# EasyEDA schematic schematic.json
TITLE: Sheet_1; REV: 1.0; Date: 2024-06-18; Sheet: 1/1; Drawn By: natanon; Company: Your Company
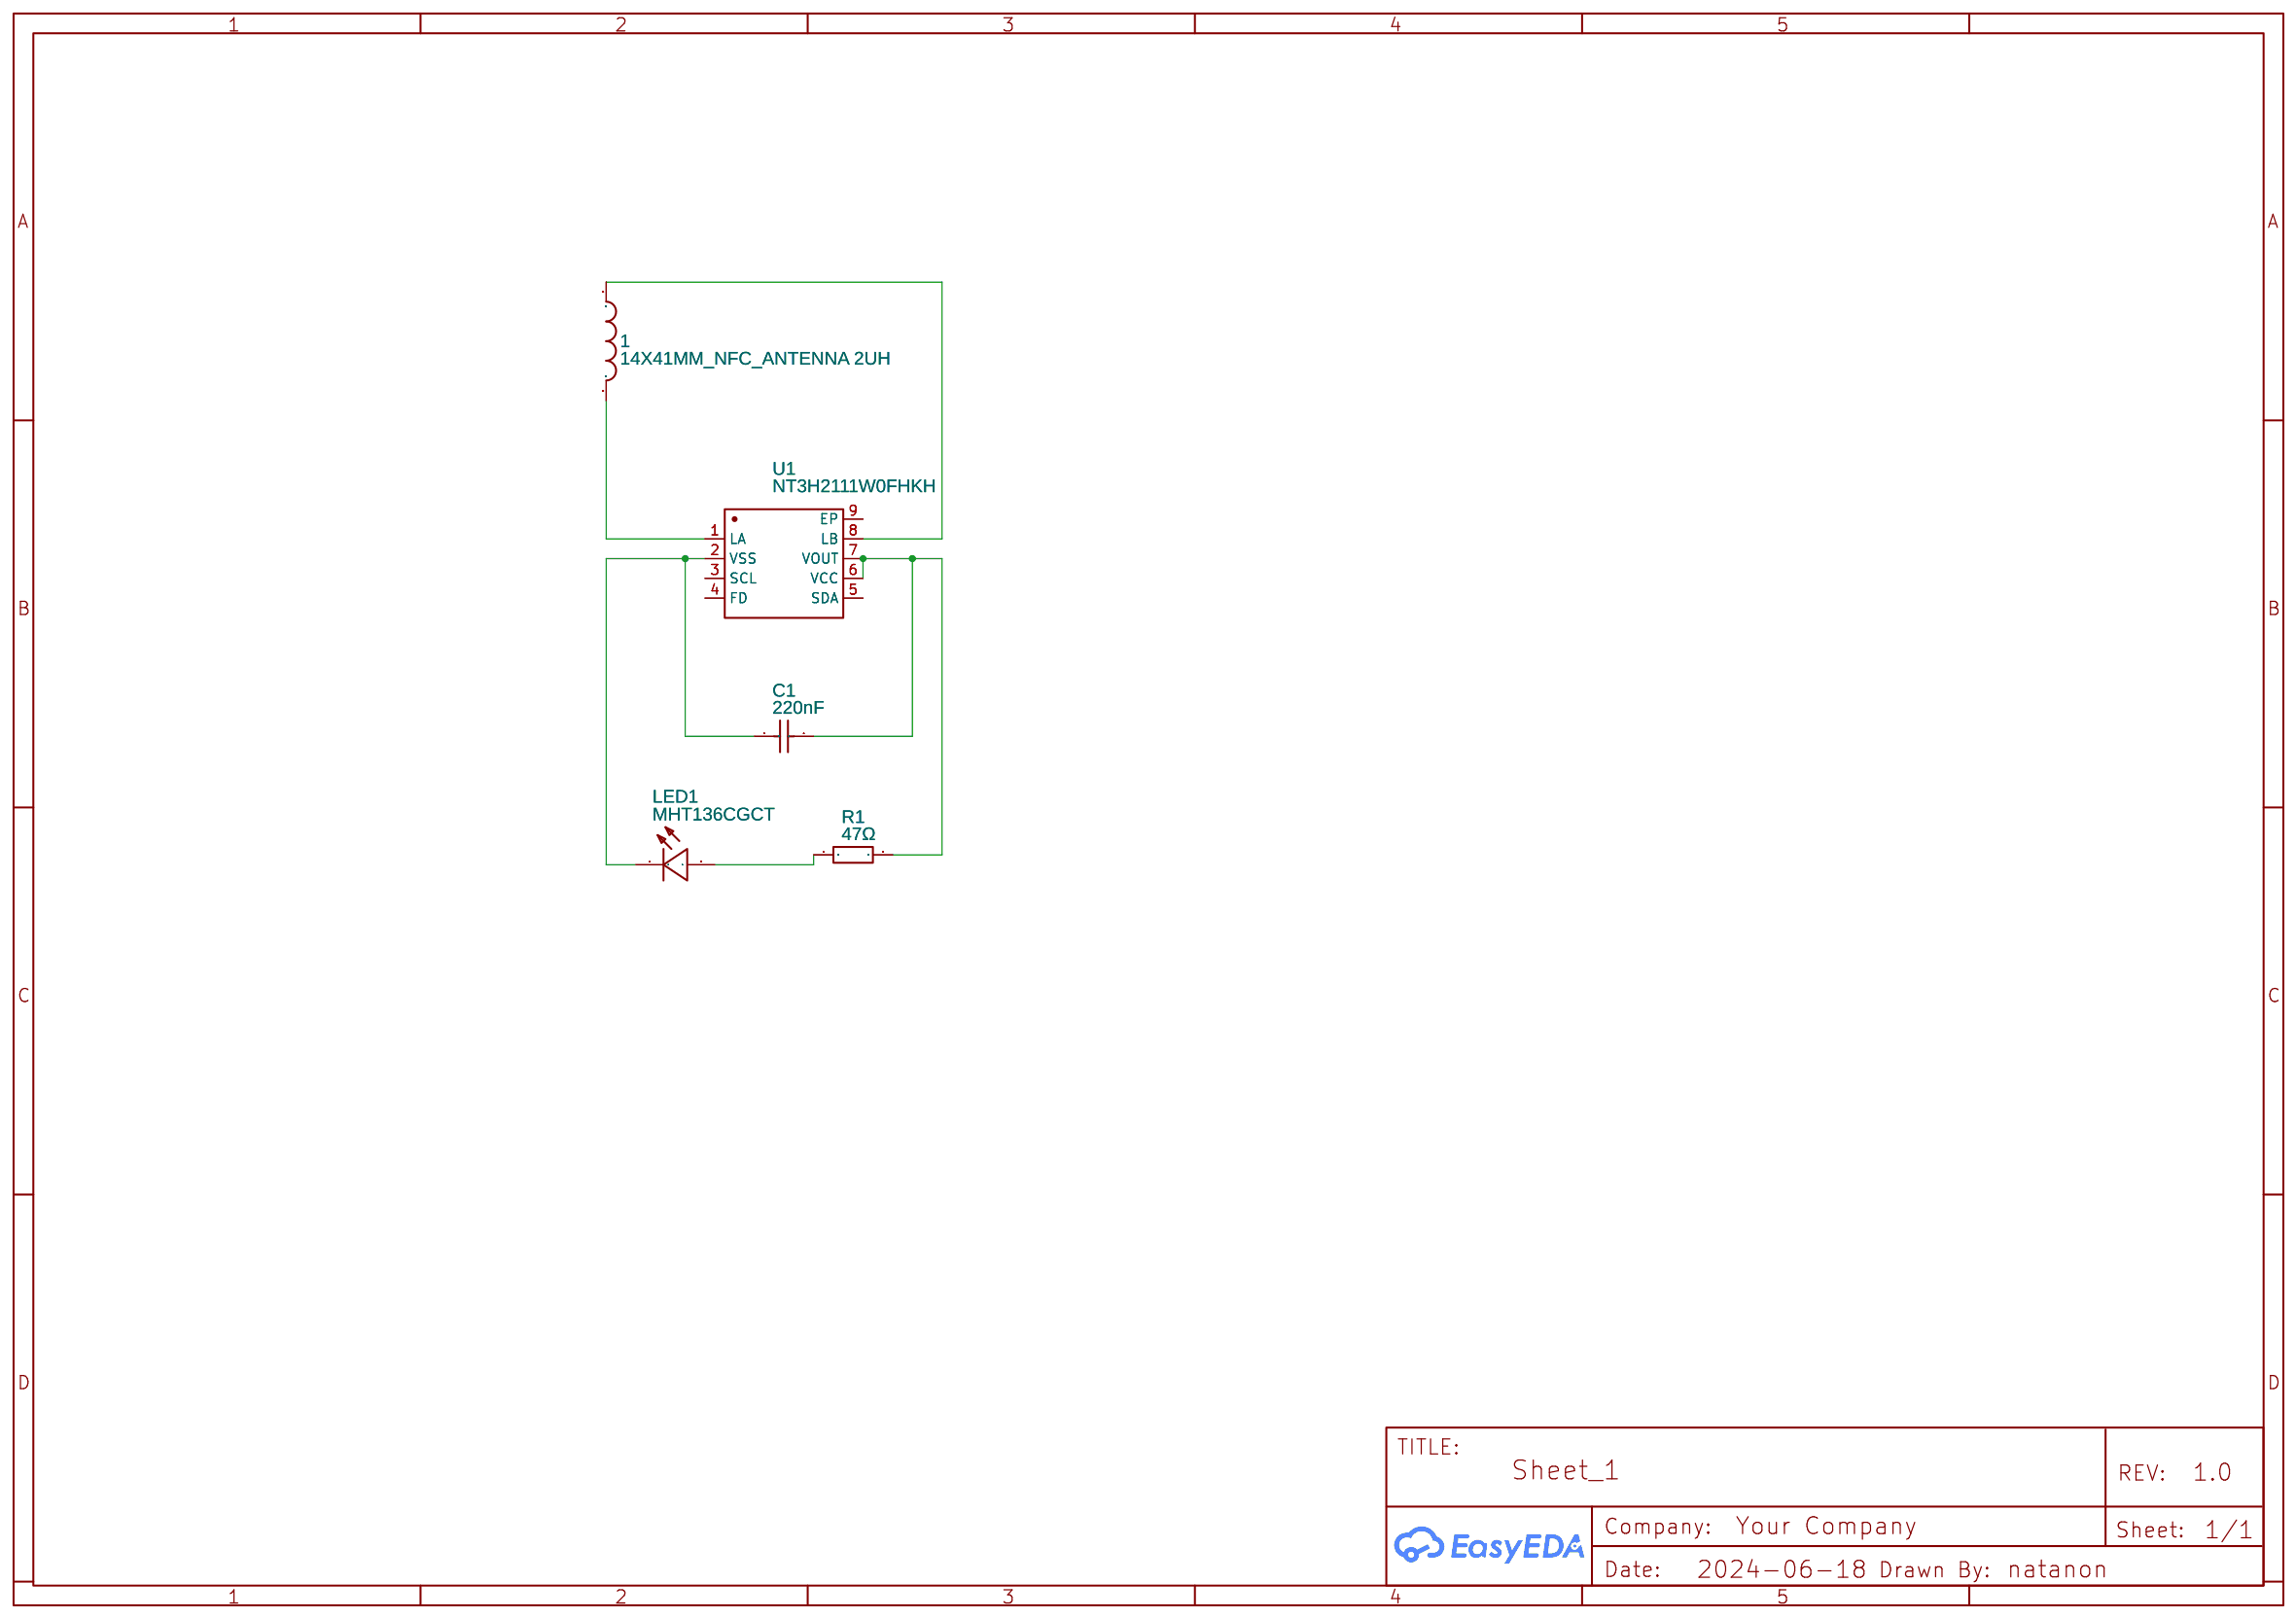
[diagram p0: schematic sheet]

## Parts
1  14X41MM_NFC_ANTENNA 2UH  [25X48MM_NFC_ANTENNA]
C1  220nF  [C0603]
LED1  MHT136CGCT  [LED0402-RD_GREEN]
R1  47Ω  [R0402]
U1  NT3H2111W0FHKH  [XQFN-8_L1.6-W1.6-P0.50-BL]

## Library data of the parts
1 = 14X41MM_NFC_ANTENNA 2UH: Contributor: svenifax
C1 = 0603B224K250NT: Supplier: LCSC; Manufacturer: FH(风华); Supplier Part: C1606; JLCPCB Part Class: Extended Part
LED1 = MHT136CGCT: Contributor: LCSC; Supplier: LCSC; Supplier Part: C401111; Manufacturer: MEIHUA(美华); JLCPCB Part Class: Extended Part
R1 = 0402WGF470JTCE: Supplier: LCSC; Manufacturer: UNI-ROYAL(厚声); Supplier Part: C25118; JLCPCB Part Class: Extended Part
U1 = NT3H2111W0FHKH: Contributor: LCSC; Supplier: LCSC; Supplier Part: C710403; Manufacturer: NXP(恩智浦); JLCPCB Part Class: Extended Part

## Nets
Net-(1-P$1): 1.P$1 U1.8(LB)
Net-(1-P$2): 1.P$2 U1.1(LA)
Net-(C1-1): C1.1 LED1.1(K) U1.2(VSS)
Net-(C1-2): C1.2 R1.2 U1.6(VCC) U1.7(VOUT)
Net-(LED1-2): LED1.2(A) R1.1

Not connected (* = marked no-connect by the designer): U1 3(SCL) 4(FD) 5(SDA) 9(EP)
